# Altium project 120W_Syn_Buck_100kHz.PrjPcb
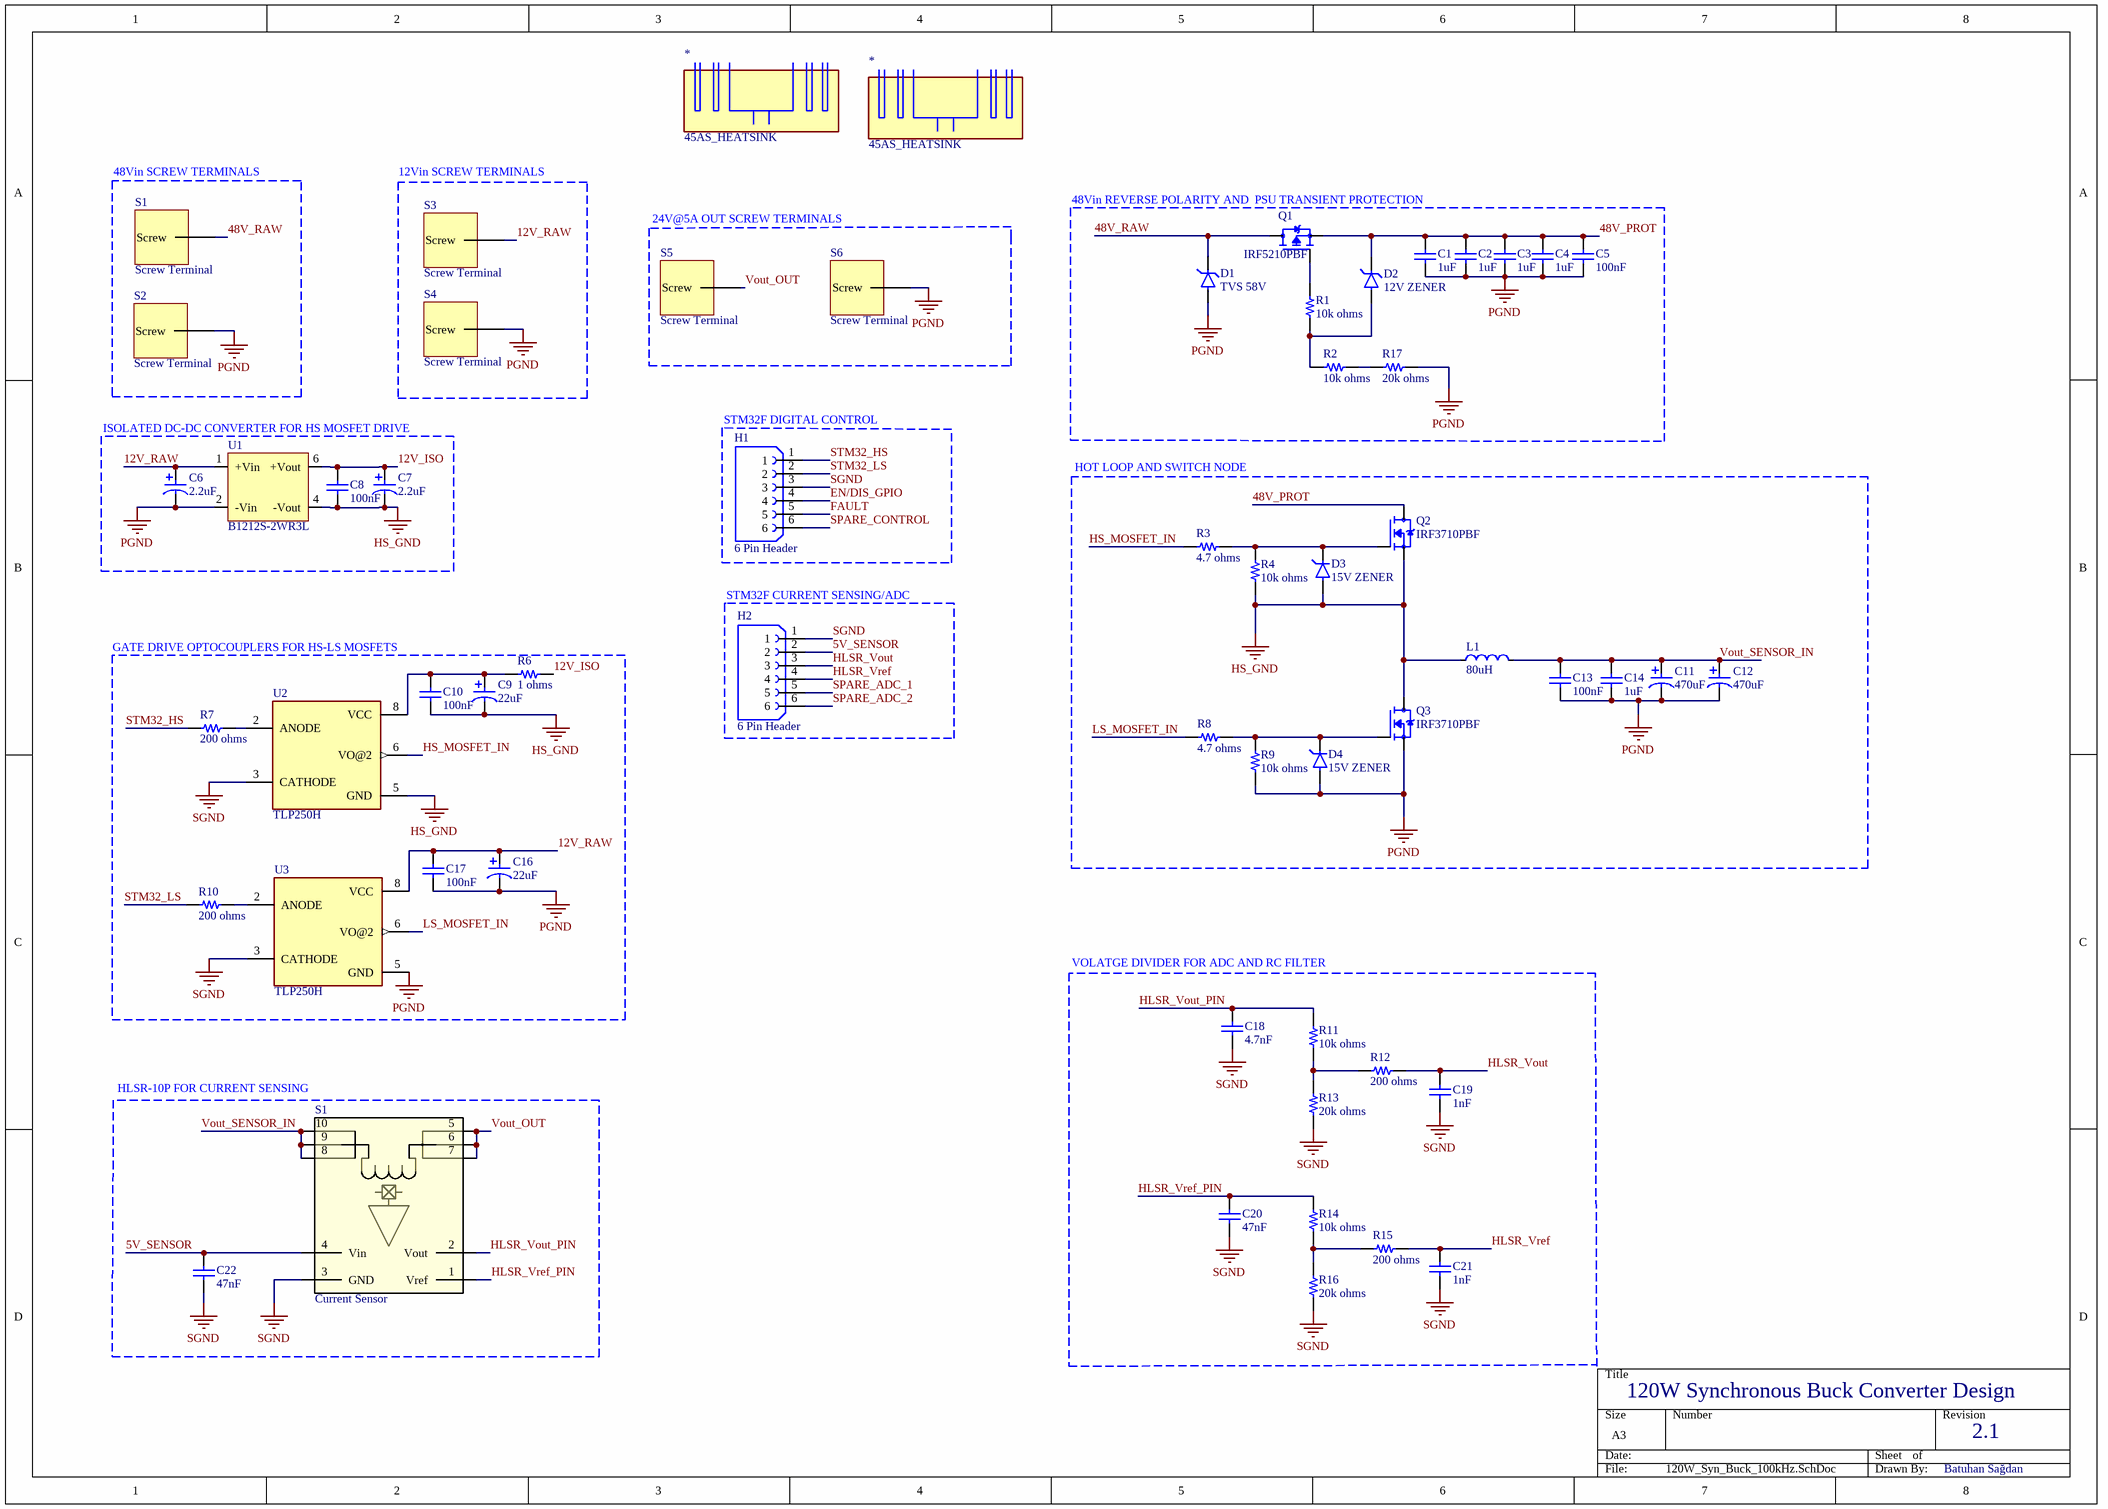
[diagram p0: 120W_Syn_Buck_100kHz.SchDoc]
1 sheet, 59 parts. Net scope: global (net labels, ports and power ports of the same name join across sheets).
Board file: 120W_Syn_Buck_100kHz.PcbDoc

## Sheet 120W_Syn_Buck_100kHz.SchDoc
size A3

### Parts
(Parts that share a designator on the sheet are numbered #1, #2 ... from top to bottom, then left to right.)
*#1  45AS_HEATSINK  [45AS_HEATSINK]
*#2  45AS_HEATSINK  [45AS_HEATSINK]
C1  1uF  [1210]
C2  1uF  [1210]
C3  1uF  [1210]
C4  1uF  [1210]
C5  100nF  [0805]
C6  2.2uF  [CAP_ELECTROLYTIC_2MM_5X11MM]
C7  2.2uF  [CAP_ELECTROLYTIC_2MM_5X11MM]
C8  100nF  [0805]
C9  22uF  [CAP_ELECTROLYTIC_2MM_5X11MM]
C10  100nF  [0805]
C11  470uF  [CAP_ELECTROLYTIC_5MM_12.5X25MM]
C12  470uF  [CAP_ELECTROLYTIC_5MM_12.5X25MM]
C13  100nF  [0805]
C14  1uF  [1210]
C16  22uF  [CAP_ELECTROLYTIC_2MM_5X11MM]
C17  100nF  [0805]
C18  4.7nF  [0805]
C19  1nF  [0805]
C20  47nF  [0805]
C21  1nF  [0805]
C22  47nF  [0805]
D1  TVS 58V  [TVS_DIODE_DO-15]
D2  12V ZENER  [ZENER_DIODE_DO-201]
D3  15V ZENER  [DO214AA_DIODE]
D4  15V ZENER  [DO214AA_DIODE]
H1  6 Pin Header  [6_PINS_HEADER_FEMALE]
H2  6 Pin Header  [6_PINS_HEADER_FEMALE]
L1  80uH  [TOROIDAL INDUCTOR]
Q1  IRF5210PBF  [IRF5210PBF_TO-220]
Q2  IRF3710PBF  [IRF3710PBF_TO-220]
Q3  IRF3710PBF  [IRF3710PBF_TO-220]
R1  10k ohms  [1210]
R2  10k ohms  [1210]
R3  4.7 ohms  [1210]
R4  10k ohms  [1210]
R6  1 ohms  [1210]
R7  200 ohms  [1210]
R8  4.7 ohms  [1210]
R9  10k ohms  [1210]
R10  200 ohms  [1210]
R11  10k ohms  [1210]
R12  200 ohms  [1210]
R13  20k ohms  [0805]
R14  10k ohms  [1210]
R15  200 ohms  [1210]
R16  20k ohms  [0805]
R17  20k ohms  [0805]
S1#1  Screw Terminal  [SCREW_TERMINAL_5x7.2MM_2MM]
S1#2  Current Sensor  [HLSR-10P]
S2  Screw Terminal  [SCREW_TERMINAL_5x7.2MM_2MM]
S3  Screw Terminal  [SCREW_TERMINAL_5x7.2MM_2MM]
S4  Screw Terminal  [SCREW_TERMINAL_5x7.2MM_2MM]
S5  Screw Terminal  [SCREW_TERMINAL_5x7.2MM_2MM]
S6  Screw Terminal  [SCREW_TERMINAL_5x7.2MM_2MM]
U1  B1212S-2WR3L  [B1212S-2WR3L_SIP-4]
U2  TLP250H  [TLP250H_DIP-8]
U3  TLP250H  [TLP250H_DIP-8]

### Blocks framed on the sheet
48Vin SCREW TERMINALS: S1#1 S2
12Vin SCREW TERMINALS: S3 S4
24V@5A OUT SCREW TERMINALS: S5 S6
48Vin REVERSE POLARITY AND  PSU TRANSIENT PROTECTION: C1-C5 D1 D2 Q1 R1 R2 R17
ISOLATED DC-DC CONVERTER FOR HS MOSFET DRIVE: C6-C8 U1
STM32F DIGITAL CONTROL: H1
HOT LOOP AND SWITCH NODE: C11-C14 D3 D4 L1 Q2 Q3 R3 R4 R8 R9
STM32F CURRENT SENSING/ADC: H2
GATE DRIVE OPTOCOUPLERS FOR HS-LS MOSFETS: C9 C10 C16 C17 R6 R7 R10 U2 U3
VOLATGE DIVIDER FOR ADC AND RC FILTER: C18-C21 R11-R16
HLSR-10P FOR CURRENT SENSING: C22 S1#2

### Nets
HS_GND: C7.2 C8.1 C9.2 C10.1 D3.1(A) L1.1 Q2.3(S) Q3.2(D) R4.1 U1.4(-Vout) U2.5(GND)
PGND: C1.1 C2.1 C3.1 C4.1 C5.1 C6.2 C11.2 C12.2 C13.1 C14.1 C16.2 C17.1 D1.1(A) D4.1(A) Q3.3(S) R9.1 R17.2 S2.1(Screw) S4.1(Screw) S6.1(Screw) U1.2(-Vin) U3.5(GND)
SGND: C18.1 C19.1 C20.1 C21.1 C22.1 H1.3 H2.1 R13.1 R16.1 S1#2.3(GND) U2.3(CATHODE) U3.3(CATHODE)
5V_SENSOR: C22.2 H2.2 S1#2.4(Vin)
12V_ISO: C7.1 C8.2 R6.2 U1.6(+Vout)
12V_RAW: C6.1 C16.1 C17.2 S3.1(Screw) U1.1(+Vin) U3.8(VCC)
48V_PROT: C1.2 C2.2 C3.2 C4.2 C5.2 D2.2(K) Q1.3(S) Q2.2(D)
48V_RAW: D1.2(K) Q1.2(D) S1#1.1(Screw)
EN/DIS_GPIO: H1.4
FAULT: H1.5
HLSR_Vout: H2.3 R12.2
HLSR_Vout_PIN: C18.2 R11.2 S1#2.2(Vout)
HLSR_Vref: C21.2 H2.4 R15.2
HLSR_Vref_PIN: C20.2 R14.2 S1#2.1(Vref)
HS_MOSFET_IN: R3.1 U2.6(VO@2)
LS_MOSFET_IN: R8.1 U3.6(VO@2)
SPARE_ADC_1: H2.5
SPARE_ADC_2: H2.6
SPARE_CONTROL: H1.6
STM32_HS: H1.1 R7.1
STM32_LS: H1.2 R10.1
Vout_OUT: S1#2.5 S1#2.6 S1#2.7 S5.1(Screw)
Vout_SENSOR_IN: C11.1 C12.1 C13.2 C14.2 L1.2 S1#2.8 S1#2.9 S1#2.10
NetC9_1: C9.1 C10.2 R6.1 U2.8(VCC)
NetD2_1: D2.1(A) R1.1 R2.1
NetD3_2: D3.2(K) Q2.1(G) R3.2 R4.2
NetD4_2: D4.2(K) Q3.1(G) R8.2 R9.2
NetQ1_1: Q1.1(G) R1.2
NetR2_2: R2.2 R17.1
NetR7_2: R7.2 U2.2(ANODE)
NetR10_2: R10.2 U3.2(ANODE)
NetR11_1: R11.1 R12.1 R13.2
NetR14_1: R14.1 R15.1 R16.2

Not connected (* = marked no-connect by the designer): C19 2

### Notes on the sheet
- 120W Synchronous Buck Converter Design
- 2.1
- Batuhan Sağdan

### Library data of the parts
C1-C4 C14 = HMK325B7105KN-T: 1uF  MLCC (3225) 1210 1uF 100V 10% X7R
C5 C8 C10 C13 C17 = AC0805KKX7R0BB104: 100nF  MLCC (2012) 0805 100nF 100VDC ±10% X7R AUTOMOTIVE
C6 C7 = PKRI-050V2R2MC110-T/A5.0: 2.2uF Electrolytic Capacitor
C9 C16 = PKRM-050V220MC110-T/A5.0: 22uF Electrolytic Capacitor
C11 C12 = EEUFC1H471: 470uF Electrolytic Capacitor
C18 = CL21C472JBFNNNE: 4.7nF MLCC (2012) 0805 4.7nF 50VDC ±5%  0G (NP0)
C19 C21 = CC0805JRNPO9BN1021: 1nF  MLCC (2012) 0805 1nF 50VDC ±5% C0G (NP0)
C20 C22 = CC0805JRX7R9BB473: 47nF MLCC (2012) 0805 47nF 50VDC ±5% X7R
D1 = P6KE68A-TKS: TVS Diode 58.1V 600W
D2 = 1N5349B: 12V Zener Diode 5W
D3 D4 = 1SMB5929BT3G: 15V ZENER DIODE 3W
H1 = DS1023-1X6S21
H2 = DS1023-1X6S21: 6x1 FEMALE HEADER
L1 = INDUCTOR_LAB-MADE: 80uH Inductor
Q1 = IRF5210PBF: P-Channel Power MOSFET, TO-220AB, -100V, -40A,
Q2 Q3 = IRF3710PBF: N-Channel Power MOSFET, TO-220AB, 100V, 57A
R1 R2 R4 R9 R11 R14 = Resistor 10k ohms
R3 R8 = Resistor 4.7 ohms
R6 = Resistor 1 ohm
R7 R10 R12 R15 = Resistor 200 ohms
R13 R16 R17 = Resistor 20k ohms
S1#1 S2-S6 = K14-00AH: 1 Pin Screw Terminal
S1#2 = HLSR-10P: 10A Hall effect, open loop, +-20A, isolated
U1 = B1212S-2WR3L: 12V-12V isolated DC-DC, 2W, Hi-Link, SIP-6, Pins 3,5 NC
U2 U3 = TLP250H: LED Optocoupler, VCC-GND 100nF bypass

## Assembly variants
DNP: all parts fitted